# Altium schematic sheet Sheet3.SchDoc
size A
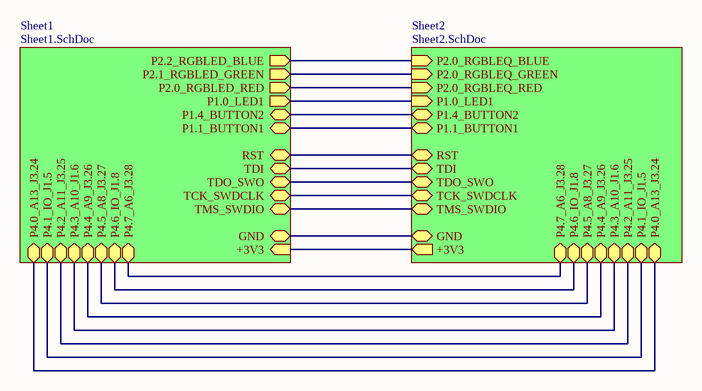
[diagram p0: Sheet3.SchDoc]

## Sub-sheets
Sheet1 = Sheet1.SchDoc: +3V3 (in), GND, P1.1_BUTTON1, P1.4_BUTTON2, RST, P1.0_LED1 (out), P2.0_RGBLED_RED (out), P2.2_RGBLED_BLUE (out), P2.1_RGBLED_GREEN (out), TDI, TDO_SWO, TCK_SWDCLK, TMS_SWDIO, P4.1_IO_J1.5, P4.2_A11_J3.25, P4.3_A10_J1.6, P4.4_A9_J3.26, P4.5_A8_J3.27, P4.6_IO_J1.8, P4.0_A13_J3.24, P4.7_A6_J3.28
Sheet2 = Sheet2.SchDoc: +3V3 (out), GND, P1.1_BUTTON1, P1.4_BUTTON2, RST, P1.0_LED1 (in), P2.0_RGBLEQ_RED (in), P2.0_RGBLEQ_GREEN (in), P2.0_RGBLEQ_BLUE (in), TDI, TDO_SWO, TCK_SWDCLK, TMS_SWDIO, P4.0_A13_J3.24, P4.1_IO_J1.5, P4.2_A11_J3.25, P4.3_A10_J1.6, P4.4_A9_J3.26, P4.5_A8_J3.27, P4.6_IO_J1.8, P4.7_A6_J3.28

## Nets
(unnamed): sheet Sheet1/+3V3, sheet Sheet2/+3V3
(unnamed): sheet Sheet1/GND, sheet Sheet2/GND
(unnamed): sheet Sheet1/P1.1_BUTTON1, sheet Sheet2/P1.1_BUTTON1
(unnamed): sheet Sheet1/P1.4_BUTTON2, sheet Sheet2/P1.4_BUTTON2
(unnamed): sheet Sheet1/RST, sheet Sheet2/RST
(unnamed): sheet Sheet1/P1.0_LED1, sheet Sheet2/P1.0_LED1
(unnamed): sheet Sheet1/P2.0_RGBLED_RED, sheet Sheet2/P2.0_RGBLEQ_RED
(unnamed): sheet Sheet1/P2.2_RGBLED_BLUE, sheet Sheet2/P2.0_RGBLEQ_BLUE
(unnamed): sheet Sheet1/P2.1_RGBLED_GREEN, sheet Sheet2/P2.0_RGBLEQ_GREEN
(unnamed): sheet Sheet1/TDI, sheet Sheet2/TDI
(unnamed): sheet Sheet1/TDO_SWO, sheet Sheet2/TDO_SWO
(unnamed): sheet Sheet1/TCK_SWDCLK, sheet Sheet2/TCK_SWDCLK
(unnamed): sheet Sheet1/TMS_SWDIO, sheet Sheet2/TMS_SWDIO
(unnamed): sheet Sheet1/P4.1_IO_J1.5, sheet Sheet2/P4.1_IO_J1.5
(unnamed): sheet Sheet1/P4.2_A11_J3.25, sheet Sheet2/P4.2_A11_J3.25
(unnamed): sheet Sheet1/P4.3_A10_J1.6, sheet Sheet2/P4.3_A10_J1.6
(unnamed): sheet Sheet1/P4.4_A9_J3.26, sheet Sheet2/P4.4_A9_J3.26
(unnamed): sheet Sheet1/P4.5_A8_J3.27, sheet Sheet2/P4.5_A8_J3.27
(unnamed): sheet Sheet1/P4.6_IO_J1.8, sheet Sheet2/P4.6_IO_J1.8
(unnamed): sheet Sheet1/P4.0_A13_J3.24, sheet Sheet2/P4.0_A13_J3.24
(unnamed): sheet Sheet1/P4.7_A6_J3.28, sheet Sheet2/P4.7_A6_J3.28